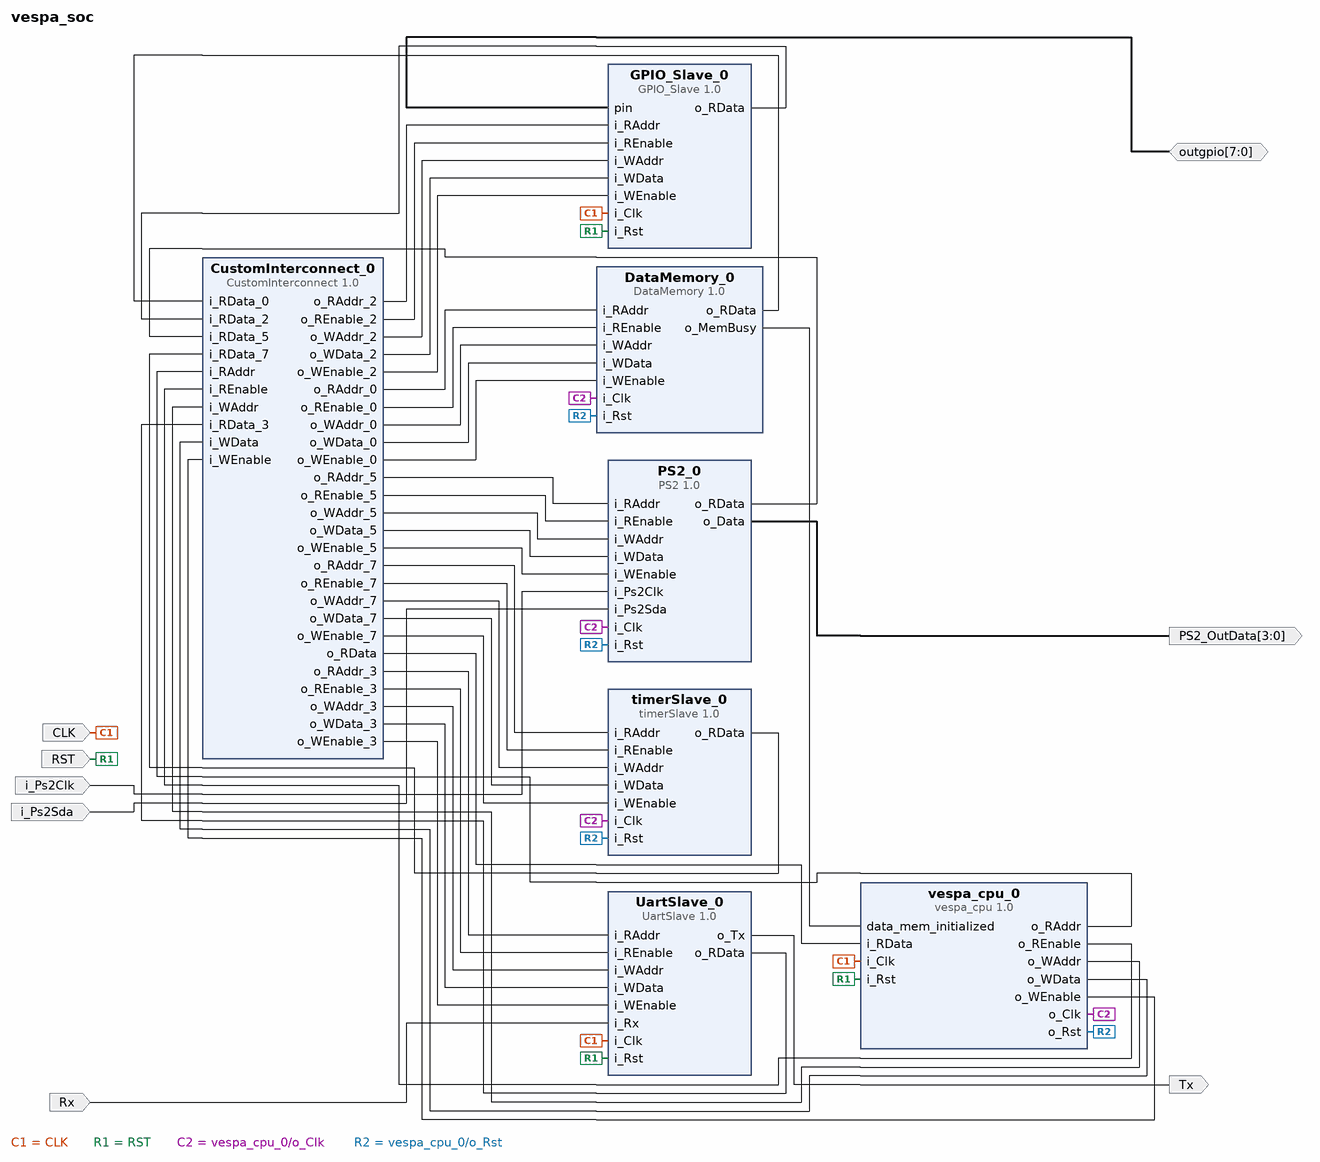
[diagram p0: block diagram of the top level]
# Vivado block design vespa_soc, xc7z010clg400-1, Vivado 2023.1
create_bd_design vespa_soc

create_bd_port -dir I CLK
create_bd_port -dir I RST
create_bd_port -dir I Rx
create_bd_port -dir O Tx
create_bd_port -dir IO -from 7 -to 0 outgpio
create_bd_port -dir I i_Ps2Clk
create_bd_port -dir I i_Ps2Sda
create_bd_port -dir O -from 3 -to 0 PS2_OutData

create_bd_cell -type ip -vlnv user.org:user:CustomInterconnect:1.0 CustomInterconnect_0
create_bd_cell -type ip -vlnv user.org:user:UartSlave:1.0 UartSlave_0
create_bd_cell -type ip -vlnv user.org:user:vespa_cpu:1.0 vespa_cpu_0
create_bd_cell -type ip -vlnv user.org:user:DataMemory:1.0 DataMemory_0
create_bd_cell -type ip -vlnv user.org:user:GPIO_Slave:1.0 GPIO_Slave_0
create_bd_cell -type ip -vlnv user.org:user:PS2:1.0 PS2_0
create_bd_cell -type ip -vlnv user.org:user:timerSlave:1.0 timerSlave_0

# ---- connections ----

connect_bd_net [get_bd_ports CLK] [get_bd_pins UartSlave_0/i_Clk] [get_bd_pins vespa_cpu_0/i_Clk] [get_bd_pins GPIO_Slave_0/i_Clk]
connect_bd_net [get_bd_pins CustomInterconnect_0/o_RAddr_0] [get_bd_pins DataMemory_0/i_RAddr]
connect_bd_net [get_bd_pins CustomInterconnect_0/o_RAddr_2] [get_bd_pins GPIO_Slave_0/i_RAddr]
connect_bd_net [get_bd_pins CustomInterconnect_0/o_RAddr_3] [get_bd_pins UartSlave_0/i_RAddr]
connect_bd_net [get_bd_pins CustomInterconnect_0/o_RAddr_5] [get_bd_pins PS2_0/i_RAddr]
connect_bd_net [get_bd_pins CustomInterconnect_0/o_RAddr_7] [get_bd_pins timerSlave_0/i_RAddr]
connect_bd_net [get_bd_pins CustomInterconnect_0/o_RData] [get_bd_pins vespa_cpu_0/i_RData]
connect_bd_net [get_bd_pins CustomInterconnect_0/o_REnable_0] [get_bd_pins DataMemory_0/i_REnable]
connect_bd_net [get_bd_pins CustomInterconnect_0/o_REnable_2] [get_bd_pins GPIO_Slave_0/i_REnable]
connect_bd_net [get_bd_pins CustomInterconnect_0/o_REnable_3] [get_bd_pins UartSlave_0/i_REnable]
connect_bd_net [get_bd_pins CustomInterconnect_0/o_REnable_5] [get_bd_pins PS2_0/i_REnable]
connect_bd_net [get_bd_pins CustomInterconnect_0/o_REnable_7] [get_bd_pins timerSlave_0/i_REnable]
connect_bd_net [get_bd_pins CustomInterconnect_0/o_WAddr_0] [get_bd_pins DataMemory_0/i_WAddr]
connect_bd_net [get_bd_pins CustomInterconnect_0/o_WAddr_2] [get_bd_pins GPIO_Slave_0/i_WAddr]
connect_bd_net [get_bd_pins CustomInterconnect_0/o_WAddr_3] [get_bd_pins UartSlave_0/i_WAddr]
connect_bd_net [get_bd_pins CustomInterconnect_0/o_WAddr_5] [get_bd_pins PS2_0/i_WAddr]
connect_bd_net [get_bd_pins CustomInterconnect_0/o_WAddr_7] [get_bd_pins timerSlave_0/i_WAddr]
connect_bd_net [get_bd_pins CustomInterconnect_0/o_WData_0] [get_bd_pins DataMemory_0/i_WData]
connect_bd_net [get_bd_pins CustomInterconnect_0/o_WData_2] [get_bd_pins GPIO_Slave_0/i_WData]
connect_bd_net [get_bd_pins CustomInterconnect_0/o_WData_3] [get_bd_pins UartSlave_0/i_WData]
connect_bd_net [get_bd_pins CustomInterconnect_0/o_WData_5] [get_bd_pins PS2_0/i_WData]
connect_bd_net [get_bd_pins CustomInterconnect_0/o_WData_7] [get_bd_pins timerSlave_0/i_WData]
connect_bd_net [get_bd_pins CustomInterconnect_0/o_WEnable_0] [get_bd_pins DataMemory_0/i_WEnable]
connect_bd_net [get_bd_pins CustomInterconnect_0/o_WEnable_2] [get_bd_pins GPIO_Slave_0/i_WEnable]
connect_bd_net [get_bd_pins CustomInterconnect_0/o_WEnable_3] [get_bd_pins UartSlave_0/i_WEnable]
connect_bd_net [get_bd_pins CustomInterconnect_0/o_WEnable_5] [get_bd_pins PS2_0/i_WEnable]
connect_bd_net [get_bd_pins CustomInterconnect_0/o_WEnable_7] [get_bd_pins timerSlave_0/i_WEnable]
connect_bd_net [get_bd_pins DataMemory_0/o_MemBusy] [get_bd_pins vespa_cpu_0/data_mem_initialized]
connect_bd_net [get_bd_pins DataMemory_0/o_RData] [get_bd_pins CustomInterconnect_0/i_RData_0]
connect_bd_net [get_bd_pins GPIO_Slave_0/o_RData] [get_bd_pins CustomInterconnect_0/i_RData_2]
connect_bd_net [get_bd_pins PS2_0/o_Data] [get_bd_ports PS2_OutData]
connect_bd_net [get_bd_pins PS2_0/o_RData] [get_bd_pins CustomInterconnect_0/i_RData_5]
connect_bd_net [get_bd_ports RST] [get_bd_pins UartSlave_0/i_Rst] [get_bd_pins vespa_cpu_0/i_Rst] [get_bd_pins GPIO_Slave_0/i_Rst]
connect_bd_net [get_bd_pins UartSlave_0/o_RData] [get_bd_pins CustomInterconnect_0/i_RData_3]
connect_bd_net [get_bd_pins UartSlave_0/o_Tx] [get_bd_ports Tx]
connect_bd_net -net i_Ps2Clk_0_1 [get_bd_ports i_Ps2Clk] [get_bd_pins PS2_0/i_Ps2Clk]
connect_bd_net -net i_Ps2Sda_0_1 [get_bd_ports i_Ps2Sda] [get_bd_pins PS2_0/i_Ps2Sda]
connect_bd_net -net i_Rx_0_1 [get_bd_ports Rx] [get_bd_pins UartSlave_0/i_Rx]
connect_bd_net [get_bd_ports outgpio] [get_bd_pins GPIO_Slave_0/pin]
connect_bd_net [get_bd_pins timerSlave_0/o_RData] [get_bd_pins CustomInterconnect_0/i_RData_7]
connect_bd_net [get_bd_pins vespa_cpu_0/o_Clk] [get_bd_pins DataMemory_0/i_Clk] [get_bd_pins PS2_0/i_Clk] [get_bd_pins timerSlave_0/i_Clk]
connect_bd_net [get_bd_pins vespa_cpu_0/o_RAddr] [get_bd_pins CustomInterconnect_0/i_RAddr]
connect_bd_net [get_bd_pins vespa_cpu_0/o_REnable] [get_bd_pins CustomInterconnect_0/i_REnable]
connect_bd_net [get_bd_pins vespa_cpu_0/o_Rst] [get_bd_pins DataMemory_0/i_Rst] [get_bd_pins PS2_0/i_Rst] [get_bd_pins timerSlave_0/i_Rst]
connect_bd_net [get_bd_pins vespa_cpu_0/o_WAddr] [get_bd_pins CustomInterconnect_0/i_WAddr]
connect_bd_net [get_bd_pins vespa_cpu_0/o_WData] [get_bd_pins CustomInterconnect_0/i_WData]
connect_bd_net [get_bd_pins vespa_cpu_0/o_WEnable] [get_bd_pins CustomInterconnect_0/i_WEnable]

validate_bd_design
save_bd_design
